# Altium schematic sheet TopLevel.SchDoc
size A
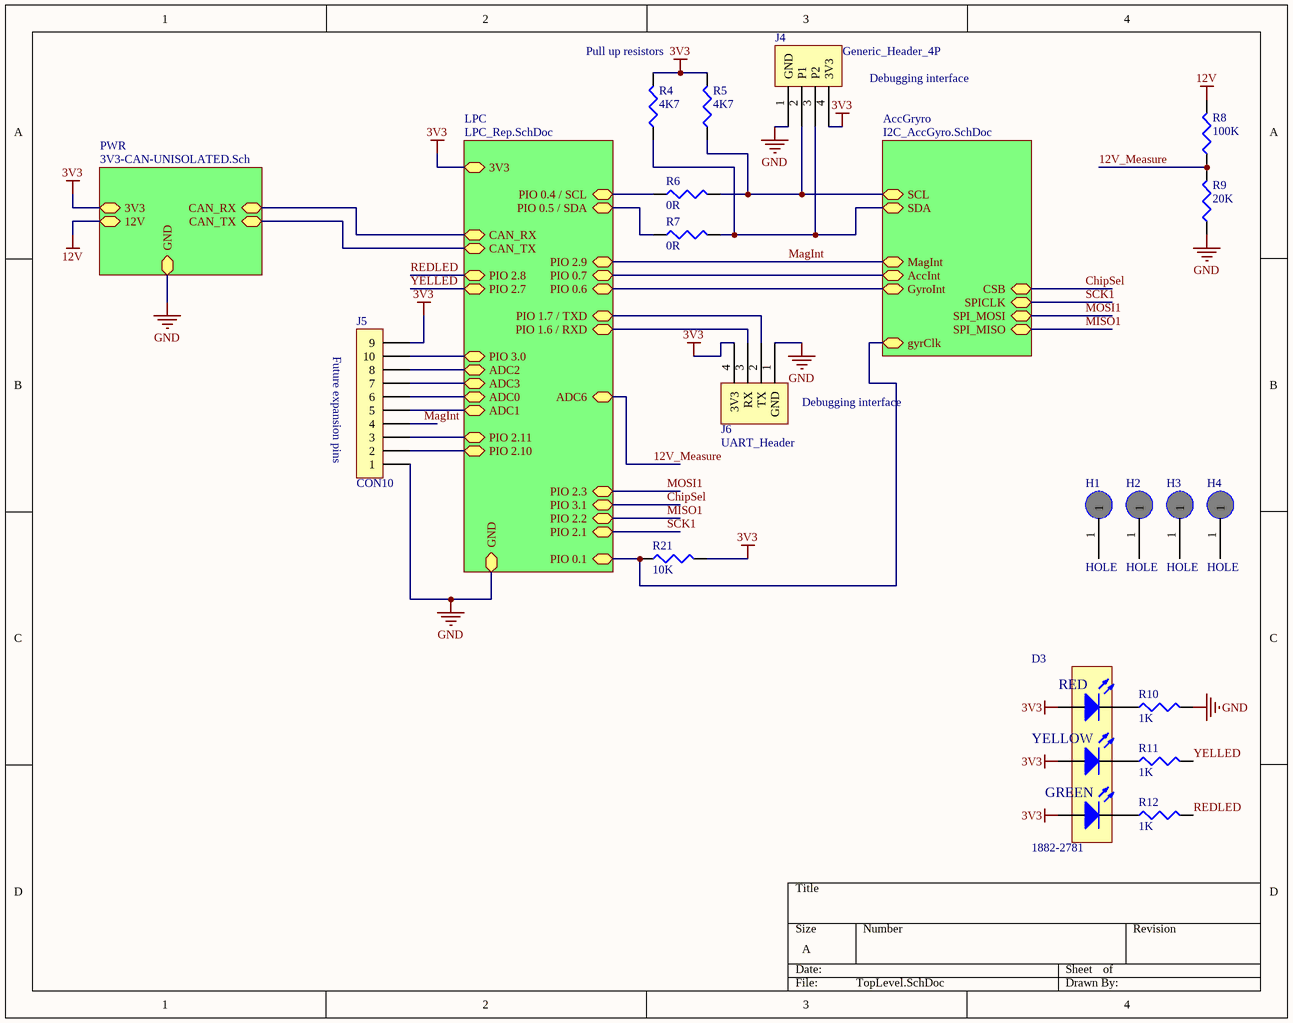
[diagram p0: TopLevel.SchDoc]

## Parts
D3  1882-2781  [LED_TRILEVEL]
H1  HOLE  [M2.5]
H2  HOLE  [M2.5]
H3  HOLE  [M2.5]
H4  HOLE  [M2.5]
J4  Generic_Header_4P  [IDC4]
J5  CON10  [IDC10]
J6  UART_Header  [IDC4]
R4  4K7  [0603]
R5  4K7  [0603]
R6  0R  [0603]
R7  0R  [0603]
R8  100K  [0603]
R9  20K  [0603]
R10  1K  [0603]
R11  1K  [0603]
R12  1K  [0603]
R21  10K  [0603]

## Sub-sheets
AccGryro = I2C_AccGyro.SchDoc: SCL (bidir), SDA (bidir), AccInt (bidir), GyroInt (bidir), MagInt (bidir), SPI_MISO (bidir), SPI_MOSI (bidir), CSB (bidir), SPICLK (bidir), gyrClk (bidir)
LPC = LPC_Rep.SchDoc: PIO 0.4 / SCL (bidir), PIO 0.5 / SDA (bidir), GND (bidir), 3V3 (bidir), CAN_RX (bidir), CAN_TX (bidir), PIO 1.6 / RXD (bidir), PIO 1.7 / TXD (bidir), ADC6 (bidir), PIO 0.7 (bidir), PIO 2.9 (bidir), PIO 2.8 (bidir), PIO 2.7 (bidir), PIO 0.6 (bidir), PIO 3.0 (bidir), ADC3 (bidir), ADC2 (bidir), ADC1 (bidir), ADC0 (bidir), PIO 2.11 (bidir), PIO 2.10 (bidir), PIO 2.3 (bidir), PIO 3.1 (bidir), PIO 2.2 (bidir), PIO 2.1 (bidir), PIO 0.1 (bidir)
PWR = 3V3-CAN-UNISOLATED.Sch: CAN_RX (bidir), CAN_TX (bidir), 3V3 (bidir), 12V (bidir), GND (bidir)

## Nets
3V3: D3.4(A) D3.5(A) D3.6(A) J4.4(3V3) J5.9 J6.4(3V3) R4.2 R5.2 R21.2 ; sheet LPC/3V3, sheet PWR/3V3
12V: R8.2 ; sheet PWR/12V
GND: J4.1(GND) J5.1 J6.1(GND) R9.1 R10.2 ; sheet LPC/GND, sheet PWR/GND
12V_Measure: R8.1 R9.2 ; sheet LPC/ADC6
ChipSel: sheet LPC/PIO 3.1, sheet AccGryro/CSB
MagInt: J5.4 ; sheet LPC/PIO 2.9, sheet AccGryro/MagInt
MISO1: sheet LPC/PIO 2.2, sheet AccGryro/SPI_MISO
MOSI1: sheet LPC/PIO 2.3, sheet AccGryro/SPI_MOSI
REDLED: R12.2 ; sheet LPC/PIO 2.8
SCK1: sheet LPC/PIO 2.1, sheet AccGryro/SPICLK
YELLED: R11.2 ; sheet LPC/PIO 2.7
NetD3_1: D3.1(K) R12.1
NetD3_2: D3.2(K) R11.1
NetD3_3: D3.3(K) R10.1
NetJ4_2: J4.2(P1) R5.1 R6.2 ; sheet AccGryro/SCL
NetJ4_3: J4.3(P2) R4.1 R7.2 ; sheet AccGryro/SDA
NetJ5_2: J5.2 ; sheet LPC/PIO 2.10
NetJ5_3: J5.3 ; sheet LPC/PIO 2.11
NetJ5_5: J5.5 ; sheet LPC/ADC1
NetJ5_6: J5.6 ; sheet LPC/ADC0
NetJ5_7: J5.7 ; sheet LPC/ADC3
NetJ5_8: J5.8 ; sheet LPC/ADC2
NetJ5_10: J5.10 ; sheet LPC/PIO 3.0
NetJ6_2: J6.2(TX) ; sheet LPC/PIO 1.7 / TXD
NetJ6_3: J6.3(RX) ; sheet LPC/PIO 1.6 / RXD
NetR6_1: R6.1 ; sheet LPC/PIO 0.4 / SCL
NetR7_1: R7.1 ; sheet LPC/PIO 0.5 / SDA
NetR21_1: R21.1 ; sheet LPC/PIO 0.1, sheet AccGryro/gyrClk
(unnamed): sheet LPC/CAN_RX, sheet PWR/CAN_RX
(unnamed): sheet LPC/CAN_TX, sheet PWR/CAN_TX
(unnamed): sheet LPC/PIO 0.7, sheet AccGryro/AccInt
(unnamed): sheet LPC/PIO 0.6, sheet AccGryro/GyroInt

Not connected (* = marked no-connect by the designer): H1 1; H2 1; H3 1; H4 1

## Notes on the sheet
- Pull up resistors
- (near J4) Debugging interface
- (near J5) Future expansion pins
- (near J6) Debugging interface
- (in symbol LED-TRILEVEL) RED; YELLOW; GREEN

## Library data of the parts
D3 = LED-TRILEVEL: Three level LED; Needed?: Farnell - Low Stock; Farnell: 1461596; Farnell Price: 4.56
H1-H4 = HOLE: Needed?: NO - Footprint
J4 = Generic_Header_4P: Needed?: NO - Common
J5 = CON10: 10 pin, right angle, ribbon con with claws; Needed?: NO - Common; Farnell Price: 5.46
J6 = UART_Header: Needed?: NO - Common
R4 R5 = RES1: Resistor; Value: 4.7k; Needed?: NO - HW LAB
R6-R12 R21 = RES1: Resistor; Needed?: NO - HW LAB
  R6 R7: Value: 0R
  R8: Value: 100k
  R9: Value: 20k
  R10-R12: Value: 1k
  R21: Value: 10k